# EAGLE design Whale_Lamp-base (EAGLE 8.3.1)
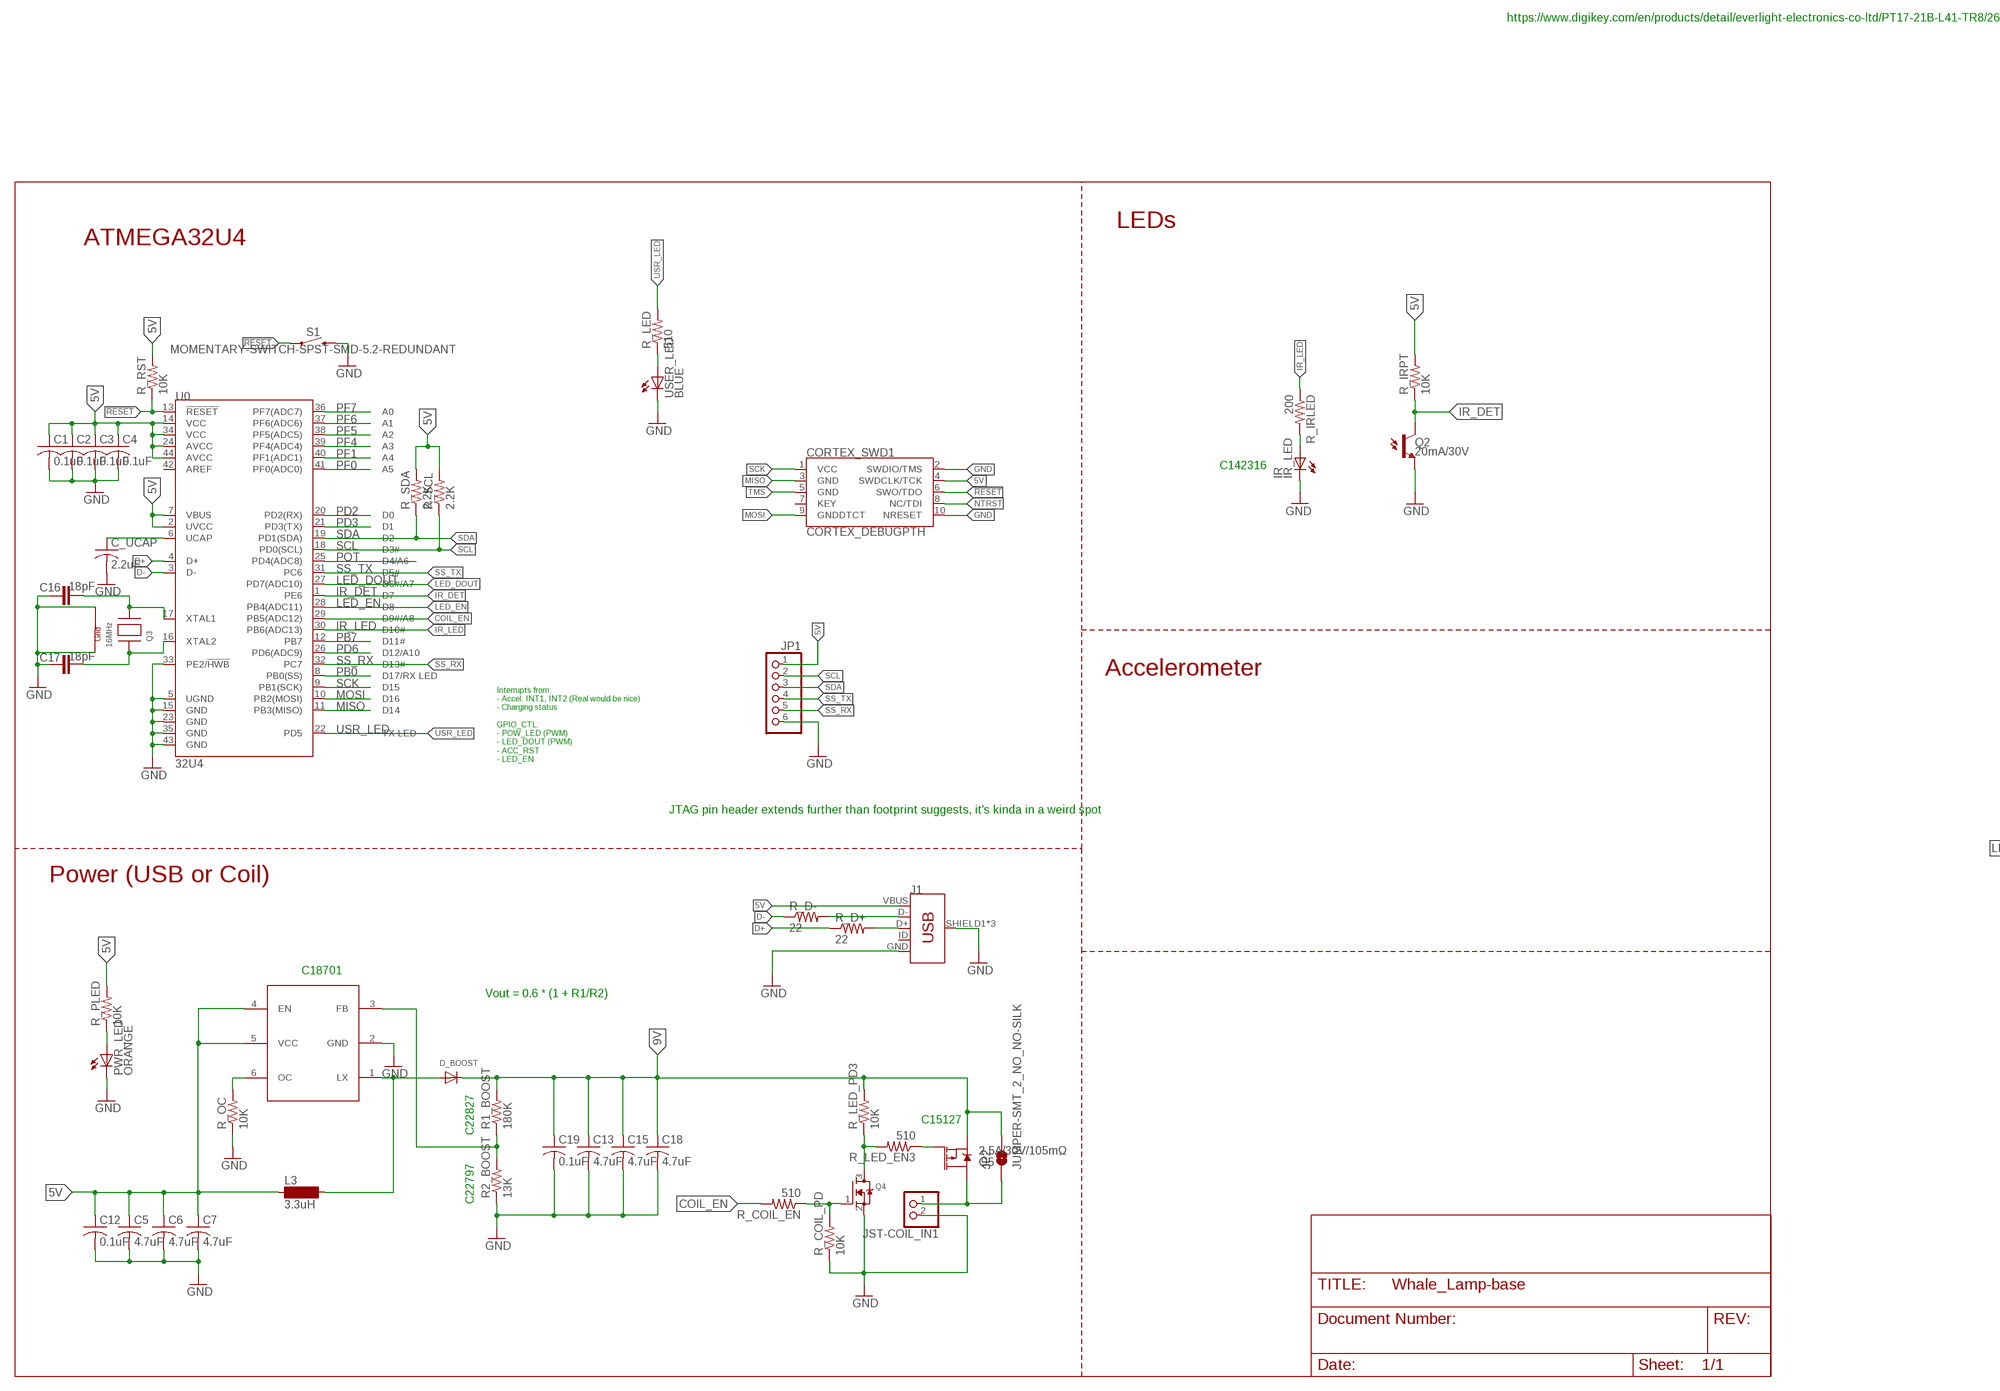
[diagram p0: schematic, sheet 1, part 1 of 2]
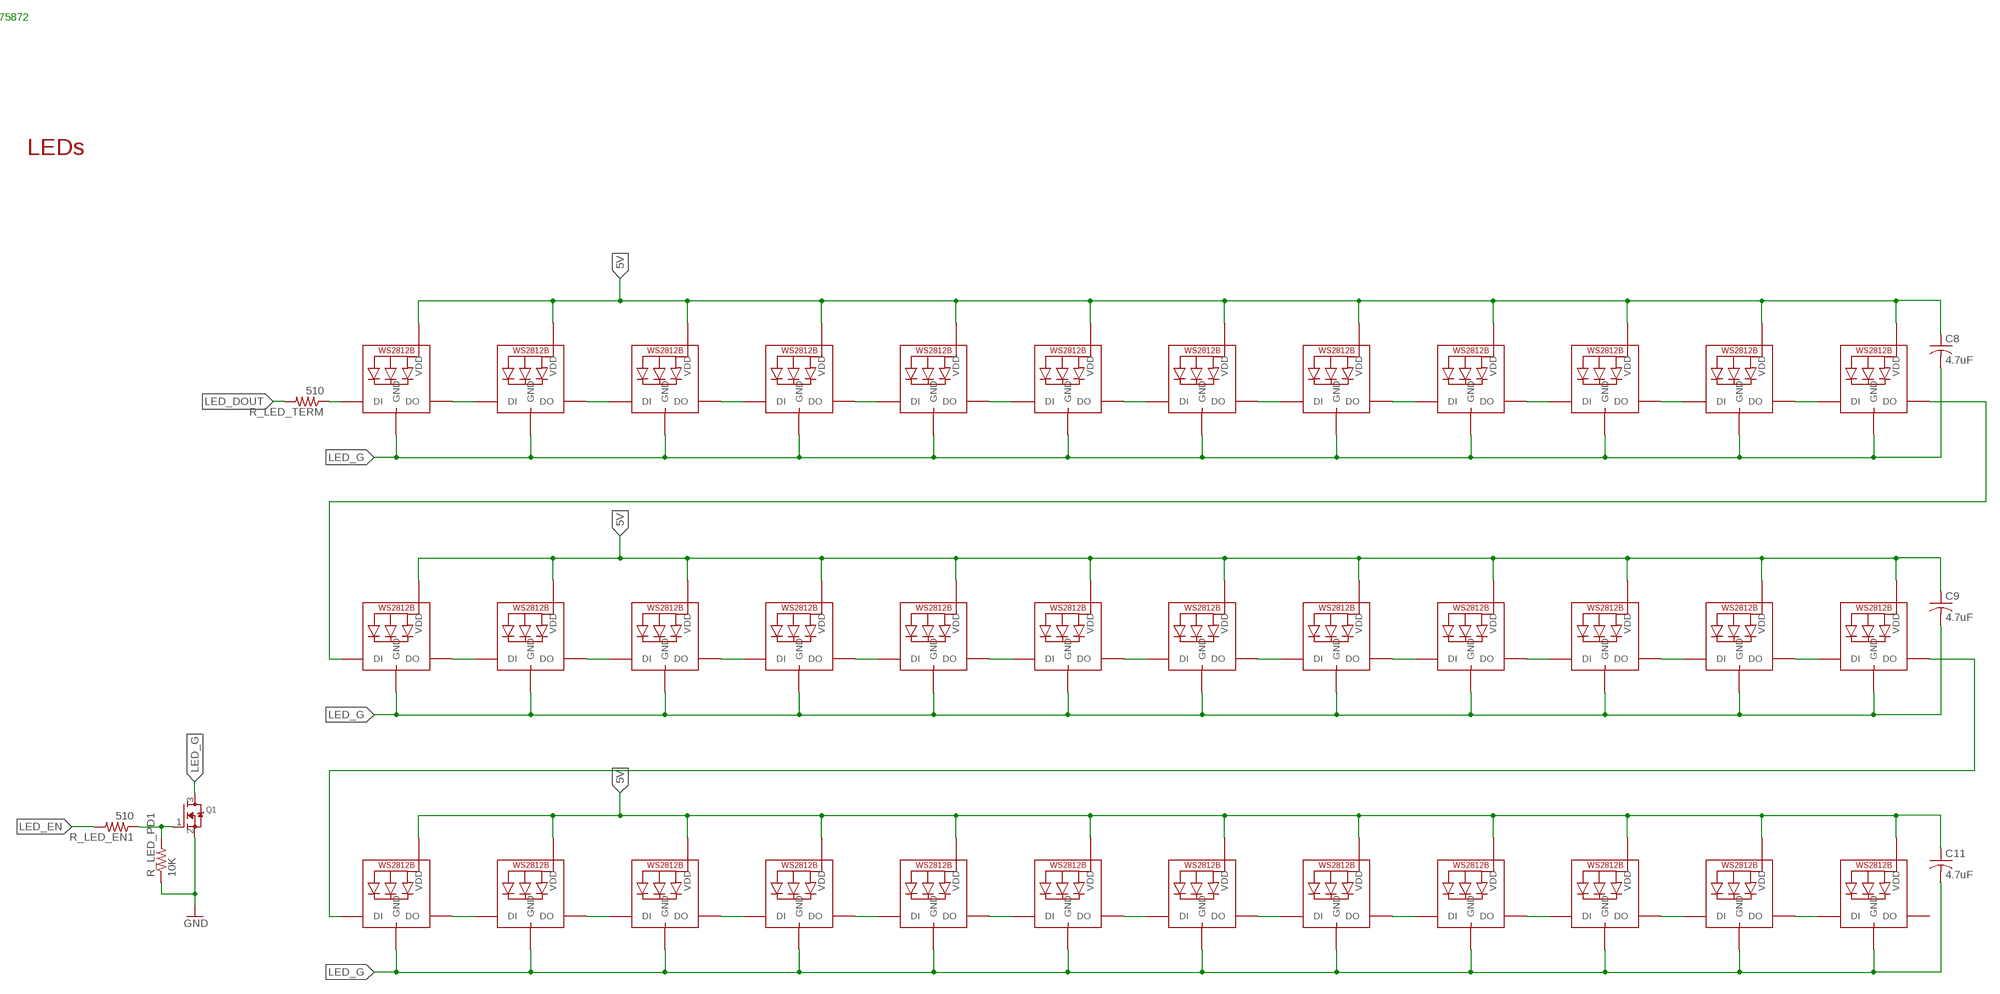
[diagram p1: schematic, sheet 1, part 2 of 2]

## Parts
C1  0.1uF  C-USC0402  [C0402]
C2  0.1uF  C-USC0402  [C0402]
C3  0.1uF  C-USC0402  [C0402]
C4  0.1uF  C-USC0402  [C0402]
C5  4.7uF  C-USC0603  [C0603]
C6  4.7uF  C-USC0603  [C0603]
C7  4.7uF  C-USC0603  [C0603]
C8  4.7uF  C-USC0603  [C0603]
C9  4.7uF  C-USC0603  [C0603]
C11  4.7uF  C-USC0603  [C0603]
C12  0.1uF  C-USC0402  [C0402]
C13  4.7uF  C-USC0603  [C0603]
C15  4.7uF  C-USC0603  [C0603]
C16  18pF  CAP0402-CAP  [0402-CAP]
C17  18pF  CAP0402-CAP  [0402-CAP]
C18  4.7uF  C-USC0603  [C0603]
C19  0.1uF  C-USC0402  [C0402]
C_UCAP  2.2uF  C-USC0603  [C0603]
CORTEX_SWD1  CORTEX_DEBUGPTH  [2X5-PTH-1.27MM]
D_BOOST  DIODESOD-123  [SOD-123]
FP6291  FP6291  [SOT23-6L]
IR_LED  IR  LEDCHIPLED_0603  [CHIPLED_0603]
J1  USB_MICRO-B_FEMALE-SMT  [USB-B-MICRO-SMD]
JP1  PINHD-1X6  [1X06]
JP2  JUMPER-SMT_2_NO_NO-SILK  [SMT-JUMPER_2_NO_NO-SILK]
JST-COIL_IN1  JST_2PIN-THM-RA  [JST-PH-2-THM-RA]
L3  3.3uH  MS50  [MS50]
LED1  WS2812B_5050N  [WS2812B-NARROW]
LED2  WS2812B_5050N  [WS2812B-NARROW]
LED3  WS2812B_5050N  [WS2812B-NARROW]
LED4  WS2812B_5050N  [WS2812B-NARROW]
LED5  WS2812B_5050N  [WS2812B-NARROW]
LED6  WS2812B_5050N  [WS2812B-NARROW]
LED7  WS2812B_5050N  [WS2812B-NARROW]
LED8  WS2812B_5050N  [WS2812B-NARROW]
LED9  WS2812B_5050N  [WS2812B-NARROW]
LED10  WS2812B_5050N  [WS2812B-NARROW]
LED11  WS2812B_5050N  [WS2812B-NARROW]
LED12  WS2812B_5050N  [WS2812B-NARROW]
LED13  WS2812B_5050N  [WS2812B-NARROW]
LED14  WS2812B_5050N  [WS2812B-NARROW]
LED15  WS2812B_5050N  [WS2812B-NARROW]
LED16  WS2812B_5050N  [WS2812B-NARROW]
LED17  WS2812B_5050N  [WS2812B-NARROW]
LED18  WS2812B_5050N  [WS2812B-NARROW]
LED19  WS2812B_5050N  [WS2812B-NARROW]
LED20  WS2812B_5050N  [WS2812B-NARROW]
LED21  WS2812B_5050N  [WS2812B-NARROW]
LED22  WS2812B_5050N  [WS2812B-NARROW]
LED23  WS2812B_5050N  [WS2812B-NARROW]
LED24  WS2812B_5050N  [WS2812B-NARROW]
LED25  WS2812B_5050N  [WS2812B-NARROW]
LED26  WS2812B_5050N  [WS2812B-NARROW]
LED27  WS2812B_5050N  [WS2812B-NARROW]
LED28  WS2812B_5050N  [WS2812B-NARROW]
LED29  WS2812B_5050N  [WS2812B-NARROW]
LED30  WS2812B_5050N  [WS2812B-NARROW]
LED31  WS2812B_5050N  [WS2812B-NARROW]
LED32  WS2812B_5050N  [WS2812B-NARROW]
LED33  WS2812B_5050N  [WS2812B-NARROW]
LED34  WS2812B_5050N  [WS2812B-NARROW]
LED35  WS2812B_5050N  [WS2812B-NARROW]
LED36  WS2812B_5050N  [WS2812B-NARROW]
PWR_LED  ORANGE  LEDCHIPLED_0603  [CHIPLED_0603]
Q1  MOSFET-NREFLOW  [SOT23]
Q2  20mA/30V  PHOTOTRANSISTORPT17-21C-L41-TR8  [PT17-21C-L41-TR8]
Q3  16MHz  XTAL-4-3225  [NX3225]
Q4  MOSFET-NREFLOW  [SOT23]
Q5  2.5A/30V/105mΩ  MOSFET_PCH-DMG2307L  [SOT23-3]
R1_BOOST  180K  R-US_R0603  [R0603]
R2_BOOST  13K  R-US_R0603  [R0603]
R_COIL_EN  510  R-US_R0402  [R0402]
R_COIL_PD  10K  R-US_R0402  [R0402]
R_D+  22  R-US_R0402  [R0402]
R_D-  22  R-US_R0402  [R0402]
R_IRLED  200  R-US_R0603  [R0603]
R_IRPT  10K  R-US_R0402  [R0402]
R_LED  510  R-US_R0402  [R0402]
R_LED_EN1  510  R-US_R0402  [R0402]
R_LED_EN3  510  R-US_R0402  [R0402]
R_LED_PD1  10K  R-US_R0402  [R0402]
R_LED_PD3  10K  R-US_R0402  [R0402]
R_LED_TERM  510  R-US_R0402  [R0402]
R_OC  10K  R-US_R0402  [R0402]
R_PLED  10K  R-US_R0402  [R0402]
R_RST  10K  R-US_R0402  [R0402]
R_SCL  2.2K  R-US_R0402  [R0402]
R_SDA  2.2K  R-US_R0402  [R0402]
S1  MOMENTARY-SWITCH-SPST-SMD-5.2-REDUNDANT  [TACTILE_SWITCH_SMD_5.2MM]
U0  32U4  ATMEGA32U4QFN  [QFN-44]
USER_LED  BLUE  LEDCHIPLED_0603  [CHIPLED_0603]

## Nets
5V: C1.1 C2.1 C3.1 C4.1 C5.1 C6.1 C7.1 C8.1 C9.1 C11.1 C12.1 CORTEX_SWD1.4(SWDCLK/TCK) FP6291.4(EN) FP6291.5(VCC) J1.VBUS JP1.1 L3.1 LED1.1-VDD(VDD) LED2.1-VDD(VDD) LED3.1-VDD(VDD) LED4.1-VDD(VDD) LED5.1-VDD(VDD) LED6.1-VDD(VDD) LED7.1-VDD(VDD) LED8.1-VDD(VDD) LED9.1-VDD(VDD) LED10.1-VDD(VDD) LED11.1-VDD(VDD) LED12.1-VDD(VDD) LED13.1-VDD(VDD) LED14.1-VDD(VDD) LED15.1-VDD(VDD) LED16.1-VDD(VDD) LED17.1-VDD(VDD) LED18.1-VDD(VDD) LED19.1-VDD(VDD) LED20.1-VDD(VDD) LED21.1-VDD(VDD) LED22.1-VDD(VDD) LED23.1-VDD(VDD) LED24.1-VDD(VDD) LED25.1-VDD(VDD) LED26.1-VDD(VDD) LED27.1-VDD(VDD) LED28.1-VDD(VDD) LED29.1-VDD(VDD) LED30.1-VDD(VDD) LED31.1-VDD(VDD) LED32.1-VDD(VDD) LED33.1-VDD(VDD) LED34.1-VDD(VDD) LED35.1-VDD(VDD) LED36.1-VDD(VDD) R_IRPT.2 R_PLED.2 R_RST.2 R_SCL.2 R_SDA.2 U0.2(UVCC) U0.7(VBUS) U0.14(VCC) U0.24(AVCC) U0.34(VCC) U0.44(AVCC)
9V: C13.1 C15.1 C18.1 C19.1 D_BOOST.C JP2.2 Q5.2(S) R1_BOOST.2 R_LED_PD3.2
!RESET: CORTEX_SWD1.6(SWO/TDO) R_RST.1 S1.1 S1.2 U0.13(!RESET)
COIL_EN: R_COIL_EN.2 U0.29(PB5(ADC12))
D+: R_D+.1 U0.4(D+)
D-: R_D-.1 U0.3(D-)
GND: C1.2 C2.2 C3.2 C4.2 C5.2 C6.2 C7.2 C12.2 C13.2 C15.2 C16.1 C17.1 C18.2 C19.2 C_UCAP.2 CORTEX_SWD1.2(SWDIO/TMS) CORTEX_SWD1.10(NRESET) FP6291.2(GND) IR_LED.C J1.GND J1.SHIELD1(SHIELD) J1.SHIELD2(SHIELD) J1.SHIELD3(SHIELD) JP1.6 JST-COIL_IN1.2 PWR_LED.C Q1.2(S) Q2.E Q3.2(G2) Q3.4(G1) Q4.2(S) R2_BOOST.1 R_COIL_PD.1 R_LED_PD1.1 R_OC.1 S1.3 S1.4 U0.5(UGND) U0.15(GND) U0.23(GND) U0.33(PE2/!HWB) U0.35(GND) U0.43(GND) USER_LED.C
IR_DET: Q2.C R_IRPT.1 U0.1(PE6)
IR_LED: R_IRLED.1 U0.30(PB6(ADC13))
LED_DOUT: R_LED_TERM.2 U0.27(PD7(ADC10))
LED_EN: R_LED_EN1.2 U0.28(PB4(ADC11))
LED_G: C8.2 C9.2 C11.2 LED1.3-GND(GND) LED2.3-GND(GND) LED3.3-GND(GND) LED4.3-GND(GND) LED5.3-GND(GND) LED6.3-GND(GND) LED7.3-GND(GND) LED8.3-GND(GND) LED9.3-GND(GND) LED10.3-GND(GND) LED11.3-GND(GND) LED12.3-GND(GND) LED13.3-GND(GND) LED14.3-GND(GND) LED15.3-GND(GND) LED16.3-GND(GND) LED17.3-GND(GND) LED18.3-GND(GND) LED19.3-GND(GND) LED20.3-GND(GND) LED21.3-GND(GND) LED22.3-GND(GND) LED23.3-GND(GND) LED24.3-GND(GND) LED25.3-GND(GND) LED26.3-GND(GND) LED27.3-GND(GND) LED28.3-GND(GND) LED29.3-GND(GND) LED30.3-GND(GND) LED31.3-GND(GND) LED32.3-GND(GND) LED33.3-GND(GND) LED34.3-GND(GND) LED35.3-GND(GND) LED36.3-GND(GND) Q1.3(D)
MISO: CORTEX_SWD1.3(GND) U0.11(PB3(MISO))
MOSI: CORTEX_SWD1.9(GNDDTCT) U0.10(PB2(MOSI))
N$1: LED1.2-DOUT(DO) LED2.4-DIN(DI)
N$2: LED4.2-DOUT(DO) LED5.4-DIN(DI)
N$3: LED5.2-DOUT(DO) LED6.4-DIN(DI)
N$4: LED7.2-DOUT(DO) LED8.4-DIN(DI)
N$5: LED8.2-DOUT(DO) LED9.4-DIN(DI)
N$7: Q4.1(G) R_COIL_EN.1 R_COIL_PD.2
N$8: R_LED.1 USER_LED.A
N$9: LED13.2-DOUT(DO) LED14.4-DIN(DI)
N$10: C16.2 Q3.3(X2) U0.17(XTAL1)
N$11: C17.2 Q3.1(X1) U0.16(XTAL2)
N$12: LED14.2-DOUT(DO) LED15.4-DIN(DI)
N$13: LED12.2-DOUT(DO) LED13.4-DIN(DI)
N$14: LED16.2-DOUT(DO) LED17.4-DIN(DI)
N$15: LED17.2-DOUT(DO) LED18.4-DIN(DI)
N$16: LED19.2-DOUT(DO) LED20.4-DIN(DI)
N$17: LED20.2-DOUT(DO) LED21.4-DIN(DI)
N$18: LED21.2-DOUT(DO) LED22.4-DIN(DI)
N$19: Q5.1(G) R_LED_EN3.1
N$20: LED22.2-DOUT(DO) LED23.4-DIN(DI)
N$21: C_UCAP.1 U0.6(UCAP)
N$22: LED23.2-DOUT(DO) LED24.4-DIN(DI)
N$24: LED15.2-DOUT(DO) LED16.4-DIN(DI)
N$25: PWR_LED.A R_PLED.1
N$26: LED18.2-DOUT(DO) LED19.4-DIN(DI)
N$27: LED25.2-DOUT(DO) LED26.4-DIN(DI)
N$28: LED26.2-DOUT(DO) LED27.4-DIN(DI)
N$29: LED24.2-DOUT(DO) LED25.4-DIN(DI)
N$30: LED28.2-DOUT(DO) LED29.4-DIN(DI)
N$31: LED29.2-DOUT(DO) LED30.4-DIN(DI)
N$32: LED31.2-DOUT(DO) LED32.4-DIN(DI)
N$33: LED32.2-DOUT(DO) LED33.4-DIN(DI)
N$34: LED34.2-DOUT(DO) LED35.4-DIN(DI)
N$35: LED2.2-DOUT(DO) LED3.4-DIN(DI)
N$36: LED35.2-DOUT(DO) LED36.4-DIN(DI)
N$37: LED27.2-DOUT(DO) LED28.4-DIN(DI)
N$38: LED30.2-DOUT(DO) LED31.4-DIN(DI)
N$39: Q1.1(G) R_LED_EN1.1 R_LED_PD1.2
N$40: LED1.4-DIN(DI) R_LED_TERM.1
N$43: LED10.2-DOUT(DO) LED11.4-DIN(DI)
N$44: LED11.2-DOUT(DO) LED12.4-DIN(DI)
N$45: JP2.1 JST-COIL_IN1.1 Q5.3(D)
N$46: LED3.2-DOUT(DO) LED4.4-DIN(DI)
N$47: LED6.2-DOUT(DO) LED7.4-DIN(DI)
N$48: IR_LED.A R_IRLED.2
N$49: LED33.2-DOUT(DO) LED34.4-DIN(DI)
N$50: FP6291.6(OC) R_OC.2
N$51: J1.D- R_D-.2
N$52: D_BOOST.A FP6291.1(LX) L3.2
N$53: J1.D+ R_D+.2
N$54: FP6291.3(FB) R1_BOOST.1 R2_BOOST.2
N$56: LED9.2-DOUT(DO) LED10.4-DIN(DI)
NTRST: CORTEX_SWD1.8(NC/TDI)
PB0: U0.8(PB0(SS))
PB7: U0.12(PB7)
PCH_GATE: Q4.3(D) R_LED_EN3.2 R_LED_PD3.1
PD2: U0.20(PD2(RX))
PD3: U0.21(PD3(TX))
PD6: U0.26(PD6(ADC9))
PF0: U0.41(PF0(ADC0))
PF1: U0.40(PF1(ADC1))
PF4: U0.39(PF4(ADC4))
PF5: U0.38(PF5(ADC5))
PF6: U0.37(PF6(ADC6))
PF7: U0.36(PF7(ADC7))
POT: U0.25(PD4(ADC8))
SCK: CORTEX_SWD1.1(VCC) U0.9(PB1(SCK))
SCL: JP1.2 R_SCL.1 U0.18(PD0(SCL))
SDA: JP1.3 R_SDA.1 U0.19(PD1(SDA))
SS_RX: JP1.5 U0.32(PC7)
SS_TX: JP1.4 U0.31(PC6)
TMS: CORTEX_SWD1.5(GND)
USR_LED: R_LED.2 U0.22(PD5)
Unconnected: CORTEX_SWD1.7(KEY) J1.ID LED36.2-DOUT(DO) U0.42(AREF)

## Notes on the sheet
- https://www.digikey.com/en/products/detail/everlight-electronics-co-ltd/PT17-21B-L41-TR8/2675872
- LEDs
- ATMEGA32U4 | LEDs
- C142316
- Accelerometer
- Interrupts from:
  - Accel: INT1, INT2 (Real would be nice)
  - Charging status
  
  GPIO_CTL:
  - POW_LED (PWM)
  - LED_DOUT (PWM)
  - ACC_RST 
  - LED_EN
- JTAG pin header extends further than footprint suggests, it's kinda in a weird spot
- Power (USB or Coil)
- C18701
- Vout = 0.6 * (1 + R1/R2)
- C15127
- C22827
- C22797

## Library data of the parts
C1-C9 C11-C13 C15 C18 C19 C_UCAP = adafruit:C-US: CAPACITOR, American symbol
C16 C17 = SparkFun:CAP: Capacitor Standard 0603 ceramic capacitor, and 0.1" leaded capacitor.
CORTEX_SWD1 = samd21-temp:CORTEX_DEBUG: Cortex Debug Connector Datasheet <http://infocenter.arm.com/help/topic/com.arm.doc.faqs/attached/13634/cortex_debug_connectors.pdf>
D_BOOST = adafruit:DIODE: Diode SMADIODE - SMA Surface Mount Package 20V 1A Schottky Diode Digikey: 641-1014-6-ND DO-1N4148 - Through Hole Small Current Diode SOD-123 20V 1 A (.5mV Vf) Schottky Diode - Digikey: MBRX120TPMSCT-ND SOD-323 10V 570mA (.38mV Vf, 3ns) Schottky Diode - Digikey: ZLLS410CT-ND SOD-523 30V 30mA Schottky Diode (RB751S-40TE61) - Digikey: RB751S-40TE61CT-ND SOT23-R/W - SOT23 Package (R = Solder Paste/Reflow Ovens, W = Hand-Soldering) BAT54Film 40V 300mA - Digikey: 497-7162-1-ND
FP6291 = IC-packages_BIG-pack V1.0:FP6291
IR_LED PWR_LED USER_LED = adafruit:LED: LED OSRAM: - CHIPLED LG R971, LG N971, LY N971, LG Q971, LY Q971, LO R971, LY R971 LH N974, LH R974 LS Q976, LO Q976, LY Q976 LO Q996 - Hyper CHIPLED LW Q18S LB Q993, LB Q99A, LB R99A - SideLED LS A670, LO A670, LY A670, LG A670, LP A670 LB A673, LV A673, LT A673, LW A673 LH A674 LY A675 LS A676, LA A676, LO A676, LY A676, LW A676 LS A679, LY A679, LG A679 - Hyper Micro SIDELED® LS Y876, LA Y876, LO Y876, LY Y876 LT Y87S - SmartLED LW L88C, LW L88S LB L89C, LB L89S, LG L890 LS L89K, LO L89K, LY L89K LS L896, LA L896, LO L896, LY L896 - TOPLED LS T670, LO T670, LY T670, LG T670, LP T670 LSG T670, LSP T670, LSY T670, LOP T670, LYG T670 LG T671, LOG T671, LSG T671 LB T673, LV T673, LT T673, LW T673 LH T674 LS T676, LA T676, LO T676, LY T676, LB T676, LH T676, LSB T676, LW T676 LB T67C, LV T67C, LT T67C, LS T67K, LO T67K, LY T67K, LW E67C LS E67B, LA E67B, LO E67B, LY E67B, LB E67C, LV E67C, LT E67C LW T67C LS T679, LY T679, LG T679 LS T770, LO T770, LY T770, LG T770, LP T770 LB T773, LV T773, LT T773, LW T773 LH T774 LS E675, LA E675, LY E675, LS T675 LS T776, LA T776, LO T776, LY T776, LB T776 LHGB T686 LT T68C, LB T68C - Hyper Mini TOPLED® LB M676 - Mini TOPLED Santana® LG M470 LS M47K, LO M47K, LY M47K Source: http://www.osram.convergy.de/
J1 = SparkFun-Connectors:USB_MICRO-B: USB Type Micro-B Connector Male/female and PTH/SMT variants SparkFun Products: SparkFun microB USB Breakout <https://www.sparkfun.com/products/12035> SparkFun USB microB Plug Breakout <https://www.sparkfun.com/products/10031> SparkFun ESP8266 Thing <https://www.sparkfun.com/products/13231>; PROD_ID: CONN-11752
JP1 = pinhead:PINHD-1X6: PIN HEADER
JP2 = SparkFun-Jumpers:JUMPER-SMT_2_NO: Normally open jumper This jumper has two pads in close proximity to each other. Apply solder to close the connection. Round pads are easier to solder for beginners, but are a lot larger. SparkFun Product that uses the round pads: SparkFun EL Sequencer <https://www.sparkfun.com/products/12781>
JST-COIL_IN1 = adafruit:JST_2PIN: JST 2-Pin Connectors of various flavors SMT-RA (S2B-PH-SM4) 4UConnector #17311 SMT (B2B-PH-SM4) THM-RA (S2B-PH) THM (B2B-PH)
L3 = inductor-neosid:MS50: INDUCTOR SMD power inductor; OC_FARNELL: unknown; OC_NEWARK: unknown
LED1-LED36 = adafruit:WS2812B
Q1 Q4 = adafruit:MOSFET-N: N-Channel Mosfet 2N7002E - 60V 260mA SOT23 [Digikey: 2N7002ET1GOSTR-ND] - REEL BSH103 - 30V 850mA SOT23 [Digikey: 568-5013-1-ND]
Q2 = SparkFun-DiscreteSemi:PHOTOTRANSISTOR: Phototransistor PT17-21C/L41/TR8 is a phototransistor in miniature SMD package which is molded in a water clear with flat top view lens. The device is Spectrally matched to visible and infrared emitting diode. Datasheet <http://www.everlight.com/file/ProductFile/PT17-21C-L41-TR8.pdf> SparkFun Products: SparkFun Electric Imp imp002 Breakout <https://www.sparkfun.com/products/12958>; PROD_ID: TRANS-12141
Q3 = adafruit:XTAL-4: Classic 4-pin 3.2 x 2.5mm crystal
Q5 = SparkFun-DiscreteSemi:MOSFET_PCH: P-channel MOSFETs Voltage controlled devices that allow control of high current outputs. SparkFun Products: SparkFun ESP32 Thing <https://www.sparkfun.com/products/13907> SparkFun ESP8266 Thing <https://www.sparkfun.com/products/13231>; PROD_ID: TRANS-11308
R1_BOOST R2_BOOST R_COIL_EN R_COIL_PD R_D+ R_D- R_IRLED R_IRPT R_LED R_LED_EN1 R_LED_EN3 R_LED_PD1 R_LED_PD3 R_LED_TERM R_OC R_PLED R_RST R_SCL R_SDA = adafruit:R-US_: RESISTOR, American symbol
S1 = SparkFun-Switches:MOMENTARY-SWITCH-SPST: Momentary Switch (Pushbutton) - SPST Normally-open (NO) SPST momentary switches (buttons, pushbuttons). Variants PTH-12MM - 12mm square, through-hole Momentary Pushbutton Switch - 12mm Square <https://www.sparkfun.com/products/9190> (COM-09190) PTH-6.0MM, PTH-6.0MM-KIT - 6.0mm square, through-hole Mini Pushbutton Switch <https://www.sparkfun.com/products/97> (COM-00097) KIT package intended for soldering kit's - only one side of pads' copper is exposed. PTH-RIGHT-ANGLE-KIT - Right-angle, through-hole Right Angle Tactile Button <https://www.sparkfun.com/products/10791> - Used on SparkFun BigTime Watch Kit <https://www.sparkfun.com/products/11734> SMD-12MM - 12mm square, surface-mount Tactile Button - SMD (12mm) <https://www.sparkfun.com/products/12993> (COM-12993) Used on SparkFun PicoBoard <https://www.sparkfun.com/products/11888> SMD-4.5MM - 4.5mm Square Trackball Switch Used on SparkFun Blackberry Trackballer Breakout <https://www.sparkfun.com/products/13169> SMD-4.6MMX2.8MM - 4.60mm x 2.80mm, surface mount Used on SparkFun SAMD21 Mini Breakout <https://www.sparkfun.com/products/13664> SMD-5.2MM, SMD-5.2-REDUNDANT - 5.2mm square, surface-mount Mini Pushbutton Switch - SMD <https://www.sparkfun.com/products/8720> (COM-08720) Used on Arduino Pro Mini <https://www.sparkfun.com/products/11114> REDUNDANT package connects both switch circuits together SMD-6.0X3.5MM - 6.0 x 3.5mm, surface mount Momentary Reset Switch SMD <https://www.sparkfun.com/products/8229> (COM-08229) SMD-6.2MM-TALL - 6.2mm square, surface mount Tactile Button - SMD (6mm) <https://www.sparkfun.com/products/12992> Used on SparkFun Digital Sandbox <https://www.sparkfun.com/products/12651> SMD-RIGHT-ANGLE - Right-angle, surface mount Used on SparkFun Block for Intel® Edison - Arduino <https://www.sparkfun.com/products/13036>; PROD_ID: SWCH-08247; SF_SKU: COM-08720
U0 = SparkFun-IC-Microcontroller:ATMEGA32U4: Atmel MCU, 32KByte Atmel 44-pin 8-bit Microcontroller with 32KBytes of ISP Flash and USB Controller Datasheet <http://cdn.sparkfun.com/datasheets/Dev/Arduino/Boards/ATMega32U4.pdf> SparkFun Products LilyPad Arduino USB - ATmega32U4 Board <https://www.sparkfun.com/products/12049> (DEV-12049) Pro Micro - 5V/16MHz <https://www.sparkfun.com/products/12640> (DEV-12640) Pro Micro - 3.3V/8MHz <https://www.sparkfun.com/products/12587> (DEV-12587) Fio v3 - ATmega32U4 <https://www.sparkfun.com/products/11520> (DEV-11520) Qduino Mini <https://www.sparkfun.com/products/13614> (DEV-13614) Makey Makey - Standard Kit <https://www.sparkfun.com/products/11511> (WIG-11511) Makey Makey Deluxe Kit <https://www.sparkfun.com/products/11519> (WIG-11519); PROD_ID: IC-10828

## Net classes
2 gnd: width 0.254 mm

## Board
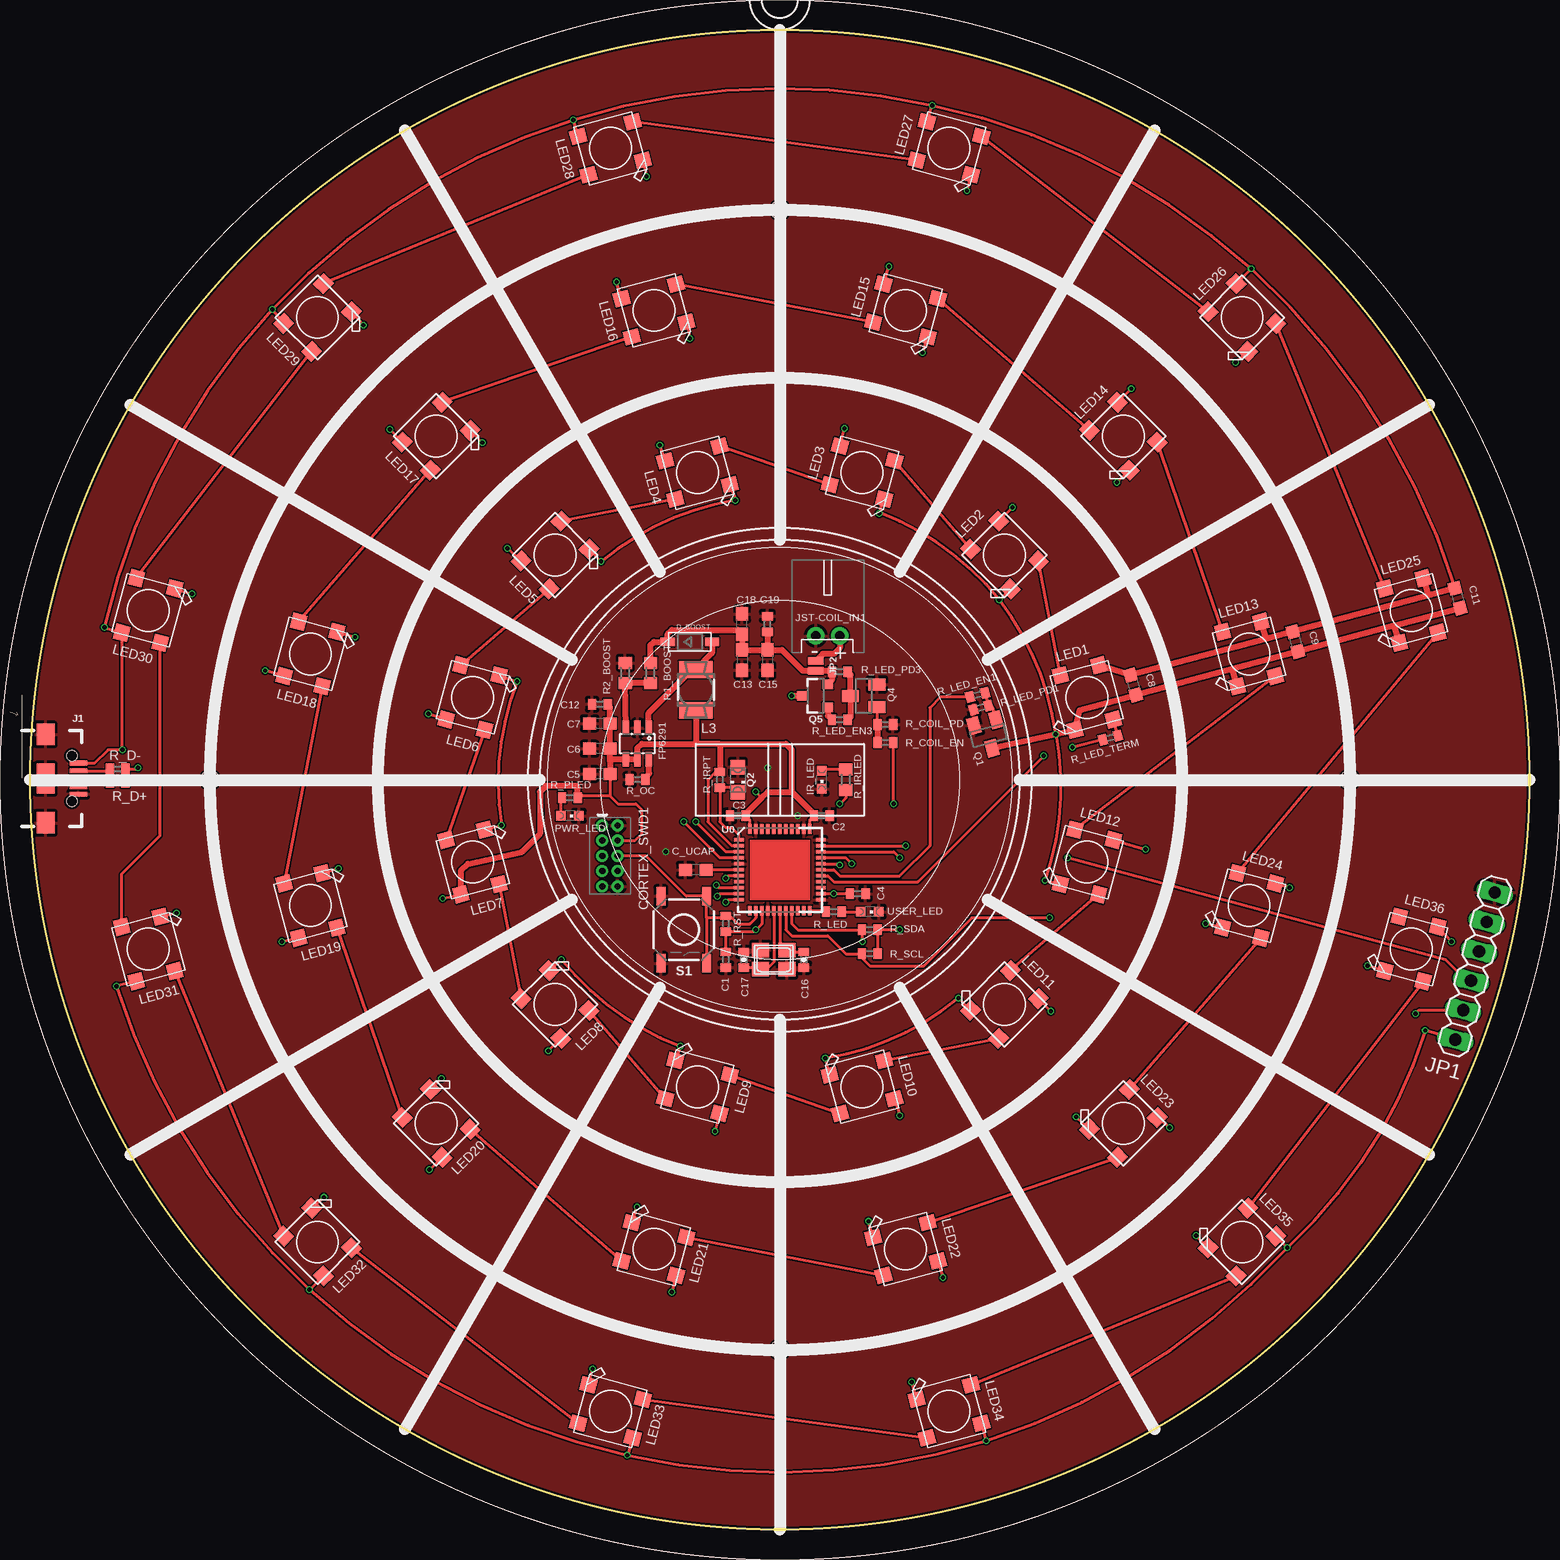
[diagram p2: board, top side]
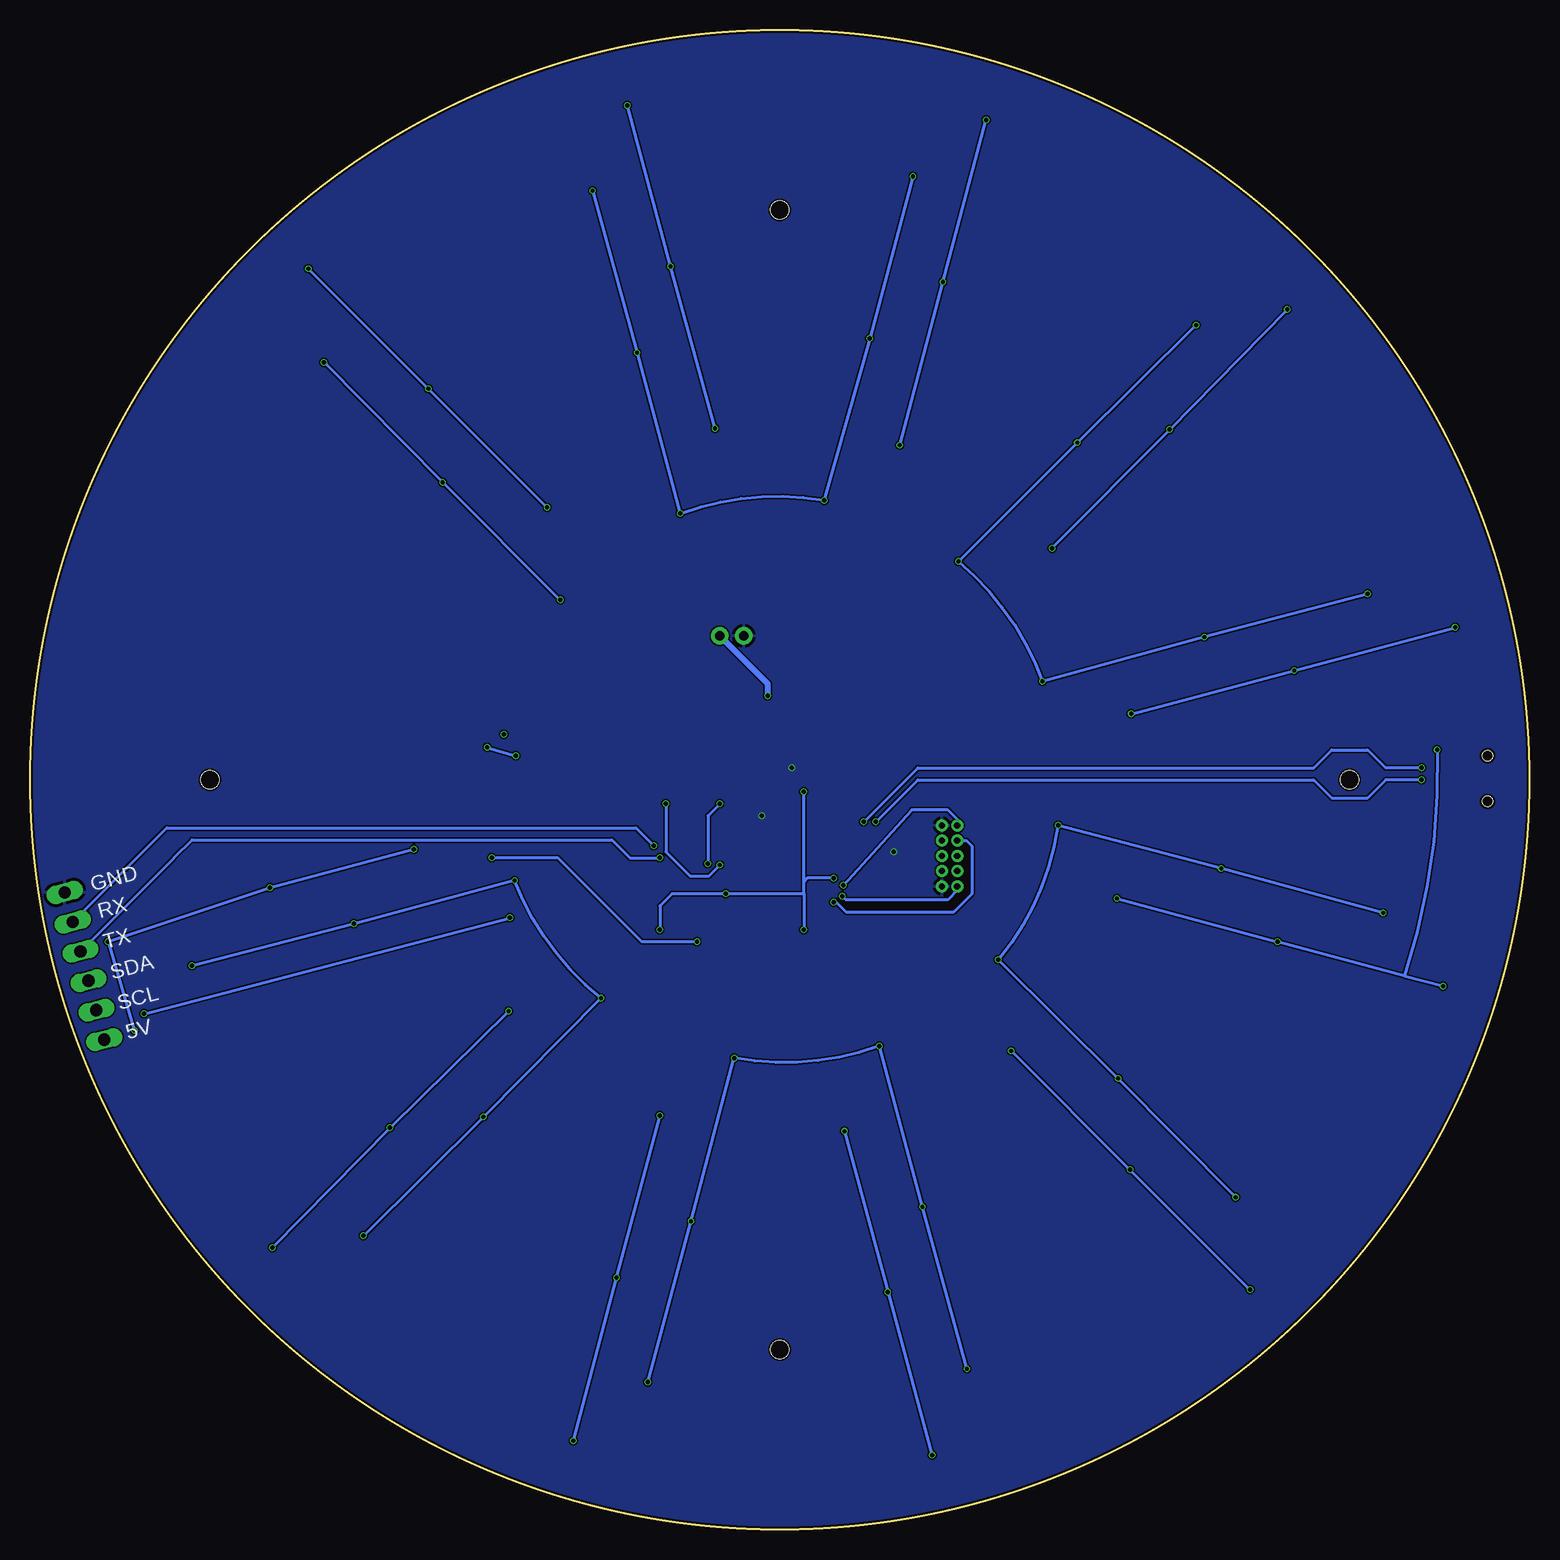
[diagram p3: board, bottom side, seen from below]

Size 125 x 125 mm. Coordinates in mm from the lower left corner, seen from the top.
Outline: circle at 62.5,62.5 radius 62.5
Copper layers (1*16): Top 0.035559375mm / dielectric 1.6mm / Bottom 0.035559375mm
Design rules "jlcpcb2layer": minimum track width 5mil, minimum drill 12mil, track to track 5mil, track to pad 5mil, pad to pad 5mil, via to via 5mil, smd to smd 5mil, copper to edge 8mil, drill to drill 6mil, minimum pad ring 5mil, minimum via ring 3mil, stop-mask expansion 2.5mil, vias tented up to drill 0mil, thermal gap 10mil
Holes 1.5 mm at 15,62.5 62.5,110 110,62.5 62.5,15

### Footprints (pad centres in the part's own frame; a part is rotated, then mirrored left to right if it is on the bottom)
C0402 = smd 0.7 x 0.9: 1 -0.65,0; 2 0.65,0
C0603 = smd 1.1 x 1: 1 -0.85,0; 2 0.85,0
0402-CAP = smd 0.7 x 0.9: 1 -0.65,0; 2 0.65,0
2X5-PTH-1.27MM = drill 0.508 pad 1: 1 -2.54,-0.635; 2 -2.54,0.635; 3 -1.27,-0.635; 4 -1.27,0.635; 5 0,-0.635; 6 0,0.635; 7 1.27,-0.635; 8 1.27,0.635; 9 2.54,-0.635; 10 2.54,0.635
SOD-123 = smd 1.2 x 0.7: A 1.85,0; C -1.85,0
SOT23-6L = smd 0.55 x 1.2: 1 -0.95,-1.3; 2 0,-1.3; 3 0.95,-1.3; 4 0.95,1.3; 5 0,1.3; 6 -0.95,1.3
CHIPLED_0603 = smd 0.8 x 0.8: A 0,-0.75; C 0,0.75
USB-B-MICRO-SMD = smd 1.45 x 0.4: D+ 2.725,0; D- 2.725,0.65; GND 2.725,-1.3; ID 2.725,-0.65; VBUS 2.725,1.3 | smd 1.5 x 1.8: SHIELD1 0,3.685; SHIELD2 0,-3.685 | smd 1.5 x 2.5: SHIELD3 0,0 | hole 0.85: 2.2,1.9; 2.2,-1.9
1X06 = drill 1.016 long: 1 -6.35,0; 2 -3.81,0; 3 -1.27,0; 4 1.27,0; 5 3.81,0; 6 6.35,0
SMT-JUMPER_2_NO_NO-SILK = smd 0.635 x 1.27: 1 -0.406,0; 2 0.406,0
JST-PH-2-THM-RA = drill 0.8 pad 1.422: 1 1,0; 2 -1,0
MS50 = smd 2.8 x 1.4: 1 0,-1.7; 2 0,1.7
WS2812B-NARROW = smd 1.3 x 1.2: 1-VDD 2.35,-1.65; 2-DOUT 2.35,1.65; 3-GND -2.35,1.65; 4-DIN -2.35,-1.65
SOT23 = smd 1 x 1.4: 1 -0.95,-1.1; 2 0.95,-1.1; 3 0,1.1
PT17-21C-L41-TR8 = smd 1.2 x 1.2: C 0,1.05; E 0,-1.05
NX3225 = smd 1.4 x 1.2: 1 -1.1,-0.8; 2 1.1,-0.8; 3 1.1,0.8; 4 -1.1,0.8
SOT23-3 = smd 0.8 x 0.9: 1 -0.95,-1; 2 0.95,-1; 3 0,1.1
R0603 = smd 1 x 1.1: 1 -0.85,0; 2 0.85,0
R0402 = smd 0.7 x 0.9: 1 -0.65,0; 2 0.65,0
TACTILE_SWITCH_SMD_5.2MM = smd 1.524 x 0.762: 1 -2.794,1.905; 2 2.794,1.905; 3 -2.794,-1.905; 4 2.794,-1.905
QFN-44 = smd 0.8 x 0.3: 1 -3.4,2.5; 2 -3.4,2; 3 -3.4,1.5; 4 -3.4,1; 5 -3.4,0.5; 6 -3.4,0; 7 -3.4,-0.5; 8 -3.4,-1; 9 -3.4,-1.5; 10 -3.4,-2; 11 -3.4,-2.5; 23 3.4,-2.5; 24 3.4,-2; 25 3.4,-1.5; 26 3.4,-1; 27 3.4,-0.5; 28 3.4,0; 29 3.4,0.5; 30 3.4,1; 31 3.4,1.5; 32 3.4,2; 33 3.4,2.5 | smd 0.3 x 0.8: 12 -2.5,-3.4; 13 -2,-3.4; 14 -1.5,-3.4; 15 -1,-3.4; 16 -0.5,-3.4; 17 0,-3.4; 18 0.5,-3.4; 19 1,-3.4; 20 1.5,-3.4; 21 2,-3.4; 22 2.5,-3.4; 34 2.5,3.4; 35 2,3.4; 36 1.5,3.4; 37 1,3.4; 38 0.5,3.4; 39 0,3.4; 40 -0.5,3.4; 41 -1,3.4; 42 -1.5,3.4; 43 -2,3.4; 44 -2.5,3.4

### Placement (x,y rotation side)
C1  58,47.5 270 top
C2  66,59.5 0 top
C3  59,59.5 180 top
C4  69,53 0 top
C5  47.5,63 180 top
C6  47.5,65.1 180 top
C7  47.5,67.2 180 top
C8  91.96,70.39 285 top
C9  105.48,74.02 285 top
C11  119.01,77.64 285 top
C12  47.5,68.8 180 top
C13  59.37,72.48 270 top
C15  61.47,72.48 270 top
C16  64.5,47.5 90 top
C17  59.5,47.5 270 top
C18  59.37,75.48 90 top
C19  61.47,75.48 90 top
C_UCAP  55.5,55 180 top
CORTEX_SWD1  48.34,56.16 270 top
D_BOOST  55,74 0 top
FP6291  50.63,65.52 180 top
IR_LED  66,62.5 180 top
J1  1.3,62.6 0 top
JP1  120.46,46.97 75 top
JP2  65.5,72 270 top
JST-COIL_IN1  66.5,74.5 0 top
L3  55.5,70 0 top
LED1  88.1,69.36 105 top
LED2  81.24,81.24 135 top
LED3  69.36,88.1 165 top
LED4  55.64,88.1 195 top
LED5  43.76,81.24 225 top
LED6  36.9,69.36 255 top
LED7  36.9,55.64 285 top
LED8  43.76,43.76 315 top
LED9  55.64,36.9 345 top
LED10  69.36,36.9 15 top
LED11  81.24,43.76 45 top
LED12  88.1,55.64 75 top
LED13  101.62,72.98 105 top
LED14  91.14,91.14 135 top
LED15  72.98,101.62 165 top
LED16  52.02,101.62 195 top
LED17  33.86,91.14 225 top
LED18  23.38,72.98 255 top
LED19  23.38,52.02 285 top
LED20  33.86,33.86 315 top
LED21  52.02,23.38 345 top
LED22  72.98,23.38 15 top
LED23  91.14,33.86 45 top
LED24  101.62,52.02 75 top
LED25  115.14,76.61 105 top
LED26  101.04,101.04 135 top
LED27  76.61,115.14 165 top
LED28  48.39,115.14 195 top
LED29  23.96,101.04 225 top
LED30  9.86,76.61 255 top
LED31  9.86,48.39 285 top
LED32  23.96,23.96 315 top
LED33  48.39,9.86 345 top
LED34  76.61,9.86 15 top
LED35  101.04,23.96 45 top
LED36  115.14,48.39 75 top
PWR_LED  45,59.5 270 top
Q1  79.9,66.2 195 top
Q2  59,62.5 180 top
Q3  62,47.5 0 top
Q4  69.5,69.5 90 top
Q5  65.5,69.5 90 top
R1_BOOST  51.72,71.4 90 top
R2_BOOST  49.62,71.4 270 top
R_COIL_EN  71.3,65.6 0 top
R_COIL_PD  71.3,67.1 180 top
R_D+  7.3,62.3 180 top
R_D-  7.3,63.4 180 top
R_IRLED  68,62.5 90 top
R_IRPT  57.5,62.5 90 top
R_LED  67,51.5 180 top
R_LED_EN1  78.99,69.58 195 top
R_LED_EN3  67.5,67.5 0 top
R_LED_PD1  79.27,68.51 15 top
R_LED_PD3  67.5,71.5 180 top
R_LED_TERM  90.06,66.01 195 top
R_OC  50.63,62.52 0 top
R_PLED  45,61 0 top
R_RST  58,50.5 270 top
R_SCL  70,48 0 top
R_SDA  70,50 0 top
S1  54.5,50 270 top
U0  62.5,55 0 top
USER_LED  70,51.5 270 top

### Tracks (layer width: path | path; a pad name or v marks a point on that pad's centre or on a via)
5V  (via drill 0.35)
  Top 0.254: U0.34 65,59.15 C2.1 | U0.44 60,59.15 C3.1 | C1.1 R_RST.2 60.35,49.85 v60.5,50 61,50.5 U0.14 | U0.2 58.5,57 56.5,59 56.5,62.5 57.15,63.15 R_IRPT.2 | C5.1 48.35,61.15 | 48.35,61.15 49,60.5 50.5,60.5 51,60 51,58 50.43,57.43 CORTEX_SWD1.4 | 48.35,61.15 45.8,61.15 R_PLED.2 | U0.7 58.2,54.5 v58,54.3 | U0.24 v67,53 C4.1 | LED10.1-VDD v72.5,34.5 | LED22.1-VDD v76.1,21 | LED34.1-VDD v79.7,7.4 | LED9.1-VDD v57.1,33.2 | LED8.1-VDD v43.2,39.9 | v34.4,52.6 LED7.1-VDD | LED6.1-VDD v33.2,68 | LED5.1-VDD v39.8,81.8 | LED4.1-VDD v52.5,90.4 | LED3.1-VDD v67.9,91.8 | LED2.1-VDD v81.9,85.2 | LED14.1-VDD v91.8,95.1 | LED26.1-VDD v101.8,105.1 | LED15.1-VDD v71.6,105.3 | LED27.1-VDD v75.2,118.7 | LED16.1-VDD v48.9,104 | LED28.1-VDD v45.3,117.5 | LED17.1-VDD v30,91.7 | LED29.1-VDD v20.2,101.7 | LED18.1-VDD v19.6,71.6 | LED19.1-VDD v21,49 | LED31.1-VDD v7.2,45.3 arc30 v23.3,20 | LED20.1-VDD v33.3,30 | LED32.1-VDD v23.3,20 | LED21.1-VDD v53.5,19.8 | LED33.1-VDD v49.8,6.2 | LED11.1-VDD v85.1,43.2 | LED23.1-VDD v95,33.5 | LED35.1-VDD v104.8,23.5 | v60.5,61.5 61,61 | v105,53.5 LED24.1-VDD | LED12.1-VDD v93,56.7 | v101.8,105.1 arc-30 C11.1 | v101.8,105.1 arc30 v75.2,118.7 | v75.2,118.7 arc30 v45.3,117.5 | v45.3,117.5 arc30 v20.2,101.7 | v20.2,101.7 arc30 v6.2,75.2 LED30.1-VDD 7.66,65.05 v7.7,65 6.5,65 5.4,63.9 J1.VBUS | v23.3,20 arc30 v49.8,6.2 | v49.8,6.2 arc30 v79.7,7.4 | v79.7,7.4 arc30 v104.8,23.5 | v104.8,23.5 arc30 v116.3,41.6 JP1.1 | LED36.1-VDD v118.5,49 | v72.5,50 R_SDA.2 R_SCL.2
  Top 0.508: C11.1 116.58,77.87 | 116.58,77.87 C9.1 103.02,74.24 | 103.02,74.24 C8.1 LED1.1-VDD | LED13.1-VDD 103.02,74.24 | LED25.1-VDD 116.58,77.87 | 48.35,64.09 C5.1 | 48.35,64.09 C6.1 C7.1 48.35,68.6 C12.1 | 55.7,68.5 L3.1 55.5,65.6 55.4,65.5 | 48.35,64.09 48.48,64.22 FP6291.4 FP6291.5 50.63,65.13 51,65.5 55.4,65.5 | 63.5,61.5 63.5,65 63,65.5 57.44,65.5 | 57.44,65.5 55.4,65.5 | C2.1 65.35,59.65 63.5,61.5 | C3.1 59.65,59.65 61,61 61.5,61.5 63.5,61.5 | 57.44,65.5 57.5,65.44 R_IRPT.2 | R_PLED.2 45.65,61.85 45.5,62 43,62 42.5,61.5 42.5,58 41,56.5 36.5,55.5 35.92,54.92 LED7.1-VDD
  Bottom 0.254: v58,54.3 60.2,54.3 60.5,54 | 60.5,53.04 60.5,54 | 60.5,53.04 v60.5,50 | 60.5,53.04 60.54,53 v67,53 71.5,53 72.5,52 v72.5,50 | v72.5,34.5 v76.1,21 v79.7,7.4 | 53.45,19.63 v53.5,19.8 | 53.45,19.63 v49.8,6.2 | v57.1,33.2 53.45,19.63 | v23.3,20 v33.3,30 v43.2,39.9 | v34.4,52.6 v21,49 10.43,46.16 | 10.43,46.16 v7.2,45.3 | v39.8,81.8 v30,91.7 v20.2,101.7 | v52.5,90.4 v48.9,104 v45.3,117.5 | v67.9,91.8 v71.6,105.3 v75.2,118.7 | v81.9,85.2 v91.8,95.1 v101.8,105.1 | v85.1,43.2 v95,33.5 v104.8,23.5 | 60.5,54 v60.5,61.5 | v93,56.7 v105,53.5 118.5,48.99 | v33.2,68 v19.6,71.6 v6.2,75.2 | 118.5,48.99 v118.5,49 | 118.5,48.99 v116.3,41.6 | v7.7,65 arc20 10.43,46.16
9V
  Top 0.508: Q5.2 66.85,70.8 R_LED_PD3.2 66.76,71.59 JP2.2 64.41,71.59 62.67,73.33 C15.1 | R1_BOOST.2 51.72,73.72 52,74 D_BOOST.C 53.15,74.65 53.5,75 59,75 C18.1 C13.1 C15.1 | C19.1 C15.1
!RESET
  Top 0.254: 56.41,51 S1.1 54.71,52.79 51.34,56.16 CORTEX_SWD1.6 | 56.41,51 S1.2 | 56.41,51 57.85,51 R_RST.1 58.35,51.15 59,50.5 60,50.5 60.5,51 U0.13
COIL_EN  (via drill 0.35)
  Top 0.254: U0.29 67.39,55.5 v67.5,55.39 | R_COIL_EN.2 71.95,60.55 v72,60.5
  Bottom 0.254: v72,60.5 72,56.5 70,54.5 68.39,54.5 v67.5,55.39
D+  (via drill 0.35)
  Top 0.254: R_D+.1 8.8,62.3 v9,62.5 | U0.4 57.5,56 v54.5,59
  Bottom 0.254: v54.5,59 51,62.5 18,62.5 16.5,61 13.5,61 12,62.5 v9,62.5
D-  (via drill 0.35)
  Top 0.254: R_D-.1 8.9,63.4 v9,63.5 | U0.3 58,56.5 v55.5,59
  Bottom 0.254: v55.5,59 51,63.5 18,63.5 16.5,65 13.5,65 12,63.5 v9,63.5
GND  (via drill 0.35)
  other vias: 64,59.5 61.5,63.5 53,56.5
  pour Top: -16.5,137 142.5,137 142.5,-9.5 -16.5,-9.5
  pour Bottom: -12,139.5 145,139.5 145,-5.5 -12,-5.5
IR_DET
  Top 0.254: Q2.C 58.6,61.85 R_IRPT.1 57.5,59 58,58.5 58.5,58.5 59.1,57.9 U0.1
IR_LED  (via drill 0.35)
  Top 0.254: U0.30 68,56 v68.5,55.5 | R_IRLED.1 68,61 v67.5,60.5
  Bottom 0.254: v67.5,60.5 68.5,59.5 v68.5,55.5
LED_DOUT  (via drill 0.35)
  Top 0.254: U0.27 66.5,54.5 67,54 74,54 v84.5,64.5 | R_LED_TERM.2 v86.9,65.2
  Bottom 0.254: v86.9,65.2 v84.5,64.5
LED_EN
  Top 0.254: U0.28 67,55 67.51,54.49 72.49,54.49 75,57 75,68.5 75.91,69.41 R_LED_EN1.2
LED_G  (via drill 0.35)
  Top 0.254: LED36.3-GND v111.5,47 | LED24.3-GND v98,50.5 | LED12.3-GND v84.6,54.1 arc30 v85.5,66.3 arc30 v80.8,77.5 | LED35.3-GND v97.2,24.5 | LED23.3-GND v87.2,34.4 | LED11.3-GND v77.4,44.3 arc-30 v66.3,39.3 LED10.3-GND | LED22.3-GND v69.9,25.7 | LED34.3-GND v73.5,12.3 | LED33.3-GND v46.9,13.4 | LED21.3-GND v50.6,26.9 | LED9.3-GND v54.2,40.3 arc-30 v44.3,47.5 | LED8.3-GND v44.3,47.5 | v44.3,47.5 | LED20.3-GND v34.3,37.6 | LED32.3-GND v24.5,27.7 | LED31.3-GND v12.2,51.4 | LED19.3-GND v25.7,55.1 | LED7.3-GND v39.3,58.7 arc-30 v40.6,70.7 LED6.3-GND | LED5.3-GND v47.6,80.7 arc-30 v58.8,85.8 LED4.3-GND | 70.82,84.76 LED3.3-GND | 70.82,84.76 v70.8,84.7 | v80.8,77.5 LED2.3-GND | LED14.3-GND v90.6,87.3 | LED26.3-GND v100.5,97.3 | LED15.3-GND v74.4,98.1 | LED27.3-GND v78.1,111.6 | LED16.3-GND v55,99.3 | LED28.3-GND v51.4,112.8 | LED29.3-GND v27.8,100.4 | LED17.3-GND v37.7,90.6 | LED18.3-GND v27.1,74.4 | LED30.3-GND v13.5,78 | v80.8,77.5 arc30 70.82,84.76
  Top 0.508: 100.22,71.73 C9.2 113.72,75.34 | 100.22,71.73 C8.2 87.5,68.3 LED1.3-GND v85.5,66.3 Q1.3 | 113.72,75.34 C11.2 | LED13.3-GND 100.22,71.73 | LED25.3-GND 113.72,75.34
  Bottom 0.254: v111.5,47 v98,50.5 v84.6,54.1 arc-30 v77.4,44.3 v87.2,34.4 v97.2,24.5 | v78.1,111.6 v74.4,98.1 v70.8,84.7 arc30 v58.8,85.8 v55,99.3 v51.4,112.8 | v80.8,77.5 v90.6,87.3 v100.5,97.3 | v27.8,100.4 v37.7,90.6 v47.6,80.7 arc30 v40.6,70.7 v27.1,74.4 v13.5,78 | v12.2,51.4 v25.7,55.1 v39.3,58.7 arc30 44.26,47.46 | v24.5,27.7 v34.3,37.6 44.26,47.46 | 44.26,47.46 v44.3,47.5 | v46.9,13.4 v50.6,26.9 v54.2,40.3 arc30 v66.3,39.3 v69.9,25.7 v73.5,12.3
MISO  (via drill 0.35)
  Top 0.254: U0.11 58.2,52.5 v58,52.3
  Bottom 0.254: v58,52.3 57.8,52.3 57,51.5 48,51.5 46.5,53 46.5,57 46.93,57.43 CORTEX_SWD1.3
MOSI  (via drill 0.35)
  Top 0.254: U0.10 57.5,53 v57.3,52.8
  Bottom 0.254: CORTEX_SWD1.9 47.7,53.3 48.5,52.5 57,52.5 v57.3,52.8
N$1
  Top 0.254: LED1.2-DOUT LED2.4-DIN
N$2
  Top 0.254: LED4.2-DOUT LED5.4-DIN
N$3
  Top 0.254: LED5.2-DOUT LED6.4-DIN
N$4
  Top 0.254: LED7.2-DOUT LED8.4-DIN
N$5
  Top 0.254: LED8.2-DOUT LED9.4-DIN
N$7
  Top 0.254: Q4.1 70.6,67.15 R_COIL_PD.2
  Top 0.508: R_COIL_PD.2 R_COIL_EN.1 | 70.9,68.85 Q4.1
N$8
  Top 0.254: R_LED.1 USER_LED.A
N$9
  Top 0.254: LED13.2-DOUT LED14.4-DIN
N$10
  Top 0.254: U0.17 62.5,48.9 Q3.3 63.25,48.15 C16.2
N$11
  Top 0.254: U0.16 62,47.3 61.4,46.7 Q3.1 60.75,46.85 C17.2
N$12
  Top 0.254: LED14.2-DOUT LED15.4-DIN
N$13
  Top 0.254: LED12.2-DOUT LED13.4-DIN
N$14
  Top 0.254: LED16.2-DOUT LED17.4-DIN
N$15
  Top 0.254: LED17.2-DOUT LED18.4-DIN
N$16
  Top 0.254: LED19.2-DOUT LED20.4-DIN
N$17
  Top 0.254: LED20.2-DOUT LED21.4-DIN
N$18
  Top 0.254: LED21.2-DOUT LED22.4-DIN
N$19
  Top 0.508: Q5.1 66.5,67.85 R_LED_EN3.1
N$20
  Top 0.254: LED22.2-DOUT LED23.4-DIN
N$21
  Top 0.254: U0.6 C_UCAP.1
N$22
  Top 0.254: LED23.2-DOUT LED24.4-DIN
N$24
  Top 0.254: LED15.2-DOUT LED16.4-DIN
N$25
  Top 0.254: PWR_LED.A 44.25,60.9 R_PLED.1
N$26
  Top 0.254: LED18.2-DOUT LED19.4-DIN
N$27
  Top 0.254: LED25.2-DOUT LED26.4-DIN
N$28
  Top 0.254: LED26.2-DOUT LED27.4-DIN
N$29
  Top 0.254: LED24.2-DOUT LED25.4-DIN
N$30
  Top 0.254: LED28.2-DOUT LED29.4-DIN
N$31
  Top 0.254: LED29.2-DOUT LED30.4-DIN
N$32
  Top 0.254: LED31.2-DOUT LED32.4-DIN
N$33
  Top 0.254: LED32.2-DOUT LED33.4-DIN
N$34
  Top 0.254: LED34.2-DOUT LED35.4-DIN
N$35
  Top 0.254: LED2.2-DOUT LED3.4-DIN
N$36
  Top 0.254: LED35.2-DOUT LED36.4-DIN
N$37
  Top 0.254: LED27.2-DOUT LED28.4-DIN
N$38
  Top 0.254: LED30.2-DOUT 10.84,57.84 7.66,54.66 LED31.4-DIN
N$39
  Top 0.254: R_LED_EN1.1 R_LED_PD1.2 80.27,68.47 Q1.1
N$40
  Top 0.254: R_LED_TERM.1 LED1.4-DIN
N$43
  Top 0.254: LED10.2-DOUT LED11.4-DIN
N$44
  Top 0.254: LED11.2-DOUT LED12.4-DIN
N$45  (via drill 0.35)
  Top 0.508: JST-COIL_IN1.1 67.5,73.5 67,73 66.09,73 JP2.1 | Q5.3 v63.5,69.5
  Bottom 0.508: v63.5,69.5 63.5,70.5 JST-COIL_IN1.1
N$46
  Top 0.254: LED3.2-DOUT LED4.4-DIN
N$47
  Top 0.254: LED6.2-DOUT LED7.4-DIN
N$48
  Top 0.254: R_IRLED.2 66.1,63.35 IR_LED.A
N$49
  Top 0.254: LED33.2-DOUT LED34.4-DIN
N$50
  Top 0.508: R_OC.2 51.32,62.53 51.62,63.04 FP6291.6
N$51
  Top 0.254: J1.D- 6.5,63.25 R_D-.2
N$52
  Top 0.508: D_BOOST.A 56.85,73.05 L3.2 55.2,71.7 51.58,68.08 FP6291.1
N$53
  Top 0.254: J1.D+ 6.35,62.6 R_D+.2
N$54
  Top 0.508: R1_BOOST.1 R2_BOOST.2 FP6291.3
N$56
  Top 0.254: LED9.2-DOUT LED10.4-DIN
PCH_GATE
  Top 0.508: R_LED_EN3.2 68.4,67.75 Q4.3 68.4,71.25 R_LED_PD3.1
SCK  (via drill 0.35)
  Top 0.254: v57.2,53.7 57.4,53.5 U0.9
  Bottom 0.254: v57.2,53.7 51.5,60 48.5,60 47.7,59.2 CORTEX_SWD1.1
SCL  (via drill 0.35)
  Top 0.254: U0.18 63,50 63.5,49.5 66.5,49.5 68,48 R_SCL.1 69.35,47.65 70,47 74.5,47 78.5,51 v85,51 | JP1.2 115.79,43.29 v115.5,43
  Bottom 0.254: v115.5,43 v85,51
SDA  (via drill 0.35)
  Top 0.254: U0.19 63.5,50.5 64,50 R_SDA.1 69.35,49.05 v69.4,49 | JP1.3 119.76,45.74 118,47.5 v86.5,56
  Bottom 0.254: v69.4,49 74,49 81,56 v86.5,56
SS_RX  (via drill 0.35)
  Top 0.254: U0.32 v73,57
  Bottom 0.254: JP1.5 113.59,58.5 74.5,58.5 v73,57
SS_TX  (via drill 0.35)
  Top 0.254: v72.5,56 72,56.5 U0.31
  Bottom 0.254: JP1.4 112.98,56 112.98,56.02 111.5,57.5 76.5,57.5 75,56 v72.5,56
USR_LED
  Top 0.254: U0.22 66.25,51.6 R_LED.2

### Text on the board
bPlace: GND | RX | TX | SDA | SCL | 5V